# EAGLE schematic UHJ Ambisonic Decoder (EAGLE 9.0.1)

## Sheet 1 of 5: PSU (1 OF 1) psu, inpt bffrs
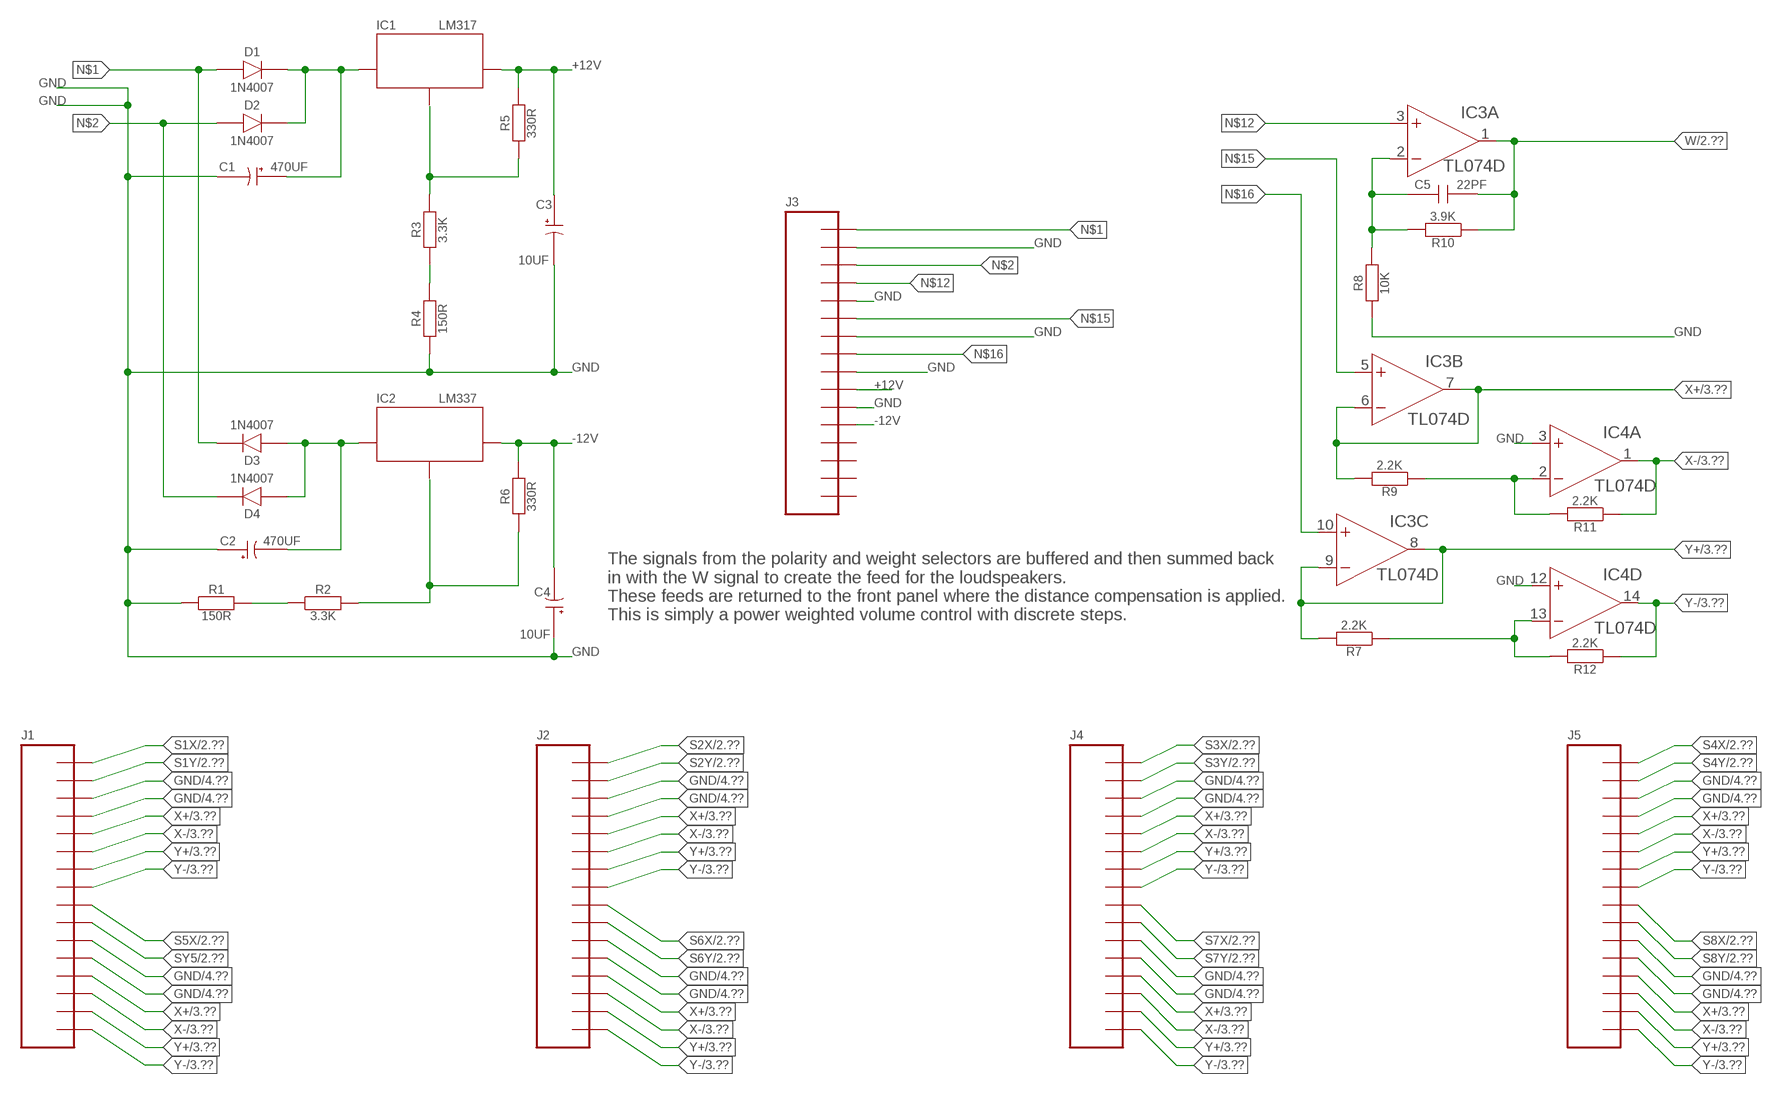
[diagram p0: schematic, sheet 1]

### Parts
C1  470UF  C+  [PANASONIC_E]
C2  470UF  C+  [PANASONIC_E]
C3  10UF  C+  [PANASONIC_E]
C4  10UF  C+  [PANASONIC_E]
C5  22PF  C  [CT6032]
D1  1N4007  D  [SOD123]
D2  1N4007  D  [SOD123]
D3  1N4007  D  [SOD123]
D4  1N4007  D  [SOD123]
IC1  LM317  VREG  [SO08]
IC2  LM337  VREG  [SO08]
IC3  TL074D  [SO14]
IC4  TL074D  [SO14]
J1  CON_16  [2X08SMT]
J2  CON_16  [2X08SMT]
J3  CON_16  [2X08SMT]
J4  CON_16  [2X08SMT]
J5  CON_16  [2X08SMT]
R1  150R  R  [R6332W]
R2  3.3K  R  [R6332W]
R3  3.3K  R  [R6332W]
R4  150R  R  [R6332W]
R5  330R  R  [R6332W]
R6  330R  R  [R6332W]
R7  2.2K  R  [R6332W]
R8  10K  R  [R6332W]
R9  2.2K  R  [R6332W]
R10  3.9K  R  [R6332W]
R11  2.2K  R  [R6332W]
R12  2.2K  R  [R6332W]

### Nets
+12V: C3.+ IC1.1(OUT) J3.10 R5.2 ; also sheet 4,5
-12V: C4.- IC2.1(OUT) J3.12 R6.2 ; also sheet 4,5
GND: C1.- C2.+ C3.- C4.+ IC4.3(A:+IN) IC4.12(D:+IN) J1.3 J1.4 J1.11 J1.12 J2.3 J2.4 J2.11 J2.12 J3.2 J3.5 J3.7 J3.9 J3.11 J4.3 J4.4 J4.11 J4.12 J5.3 J5.4 J5.11 J5.12 R1.1 R4.1 R8.1 ; also sheet 2,4,5
N$1: D1.A D3.C J3.1
N$2: D2.A D4.C J3.3
N$4: C1.+ D1.C D2.C IC1.8(IN)
N$5: C2.- D3.A D4.A IC2.8(IN)
N$7: IC1.2(GND) IC1.3(GND) IC1.6(GND) IC1.7(GND) R3.2 R5.1
N$8: R3.1 R4.2
N$10: IC2.2(GND) IC2.3(GND) IC2.6(GND) IC2.7(GND) R2.2 R6.1
N$12: IC3.3(A:+IN) J3.4
N$13: C5.- IC3.2(A:-IN) R8.2 R10.2
N$15: IC3.5(B:+IN) J3.6
N$16: IC3.10(C:+IN) J3.8
N$18: IC4.2(A:-IN) R9.1 R11.2
N$20: IC4.13(D:-IN) R7.1 R12.2
N$21: R1.2 R2.1
S1X: J1.1 ; also sheet 2
S1Y: J1.2 ; also sheet 2
S2X: J2.1 ; also sheet 2
S2Y: J2.2 ; also sheet 2
S3X: J4.1 ; also sheet 2
S3Y: J4.2 ; also sheet 2
S4X: J5.1 ; also sheet 2
S4Y: J5.2 ; also sheet 2
S5X: J1.9 ; also sheet 2
S6X: J2.9 ; also sheet 2
S6Y: J2.10 ; also sheet 2
S7X: J4.9 ; also sheet 2
S7Y: J4.10 ; also sheet 2
S8X: J5.9 ; also sheet 2
S8Y: J5.10 ; also sheet 2
SY5: J1.10 ; also sheet 2
W: C5.+ IC3.1(A:OUT) R10.1 ; also sheet 2,5
X+: IC3.6(B:-IN) IC3.7(B:OUT) J1.5 J1.13 J2.5 J2.13 J4.5 J4.13 J5.5 J5.13 R9.2 ; also sheet 3
X-: IC4.1(A:OUT) J1.6 J1.14 J2.6 J2.14 J4.6 J4.14 J5.6 J5.14 R11.1 ; also sheet 3,4
Y+: IC3.8(C:OUT) IC3.9(C:-IN) J1.7 J1.15 J2.7 J2.15 J4.7 J4.15 J5.7 J5.15 R7.2 ; also sheet 3
Y-: IC4.14(D:OUT) J1.8 J1.16 J2.8 J2.16 J4.8 J4.16 J5.8 J5.16 R12.1 ; also sheet 3,4
Unconnected: IC3.12(D:+IN) IC3.13(D:-IN) IC3.14(D:OUT) IC4.5(B:+IN) IC4.6(B:-IN) IC4.7(B:OUT) IC4.8(C:OUT) IC4.9(C:-IN) IC4.10(C:+IN) J3.13 J3.14 J3.15 J3.16

### Notes on the sheet
- The signals from the polarity and weight selectors are buffered and then summed back
  in with the W signal to create the feed for the loudspeakers. 
  These feeds are returned to the front panel where the distance compensation is applied.
  This is simply a power weighted volume control with discrete steps.

## Sheet 2 of 5: DECODER (1 OF 4) sin-cos pots, angl sel, dstnc cmp
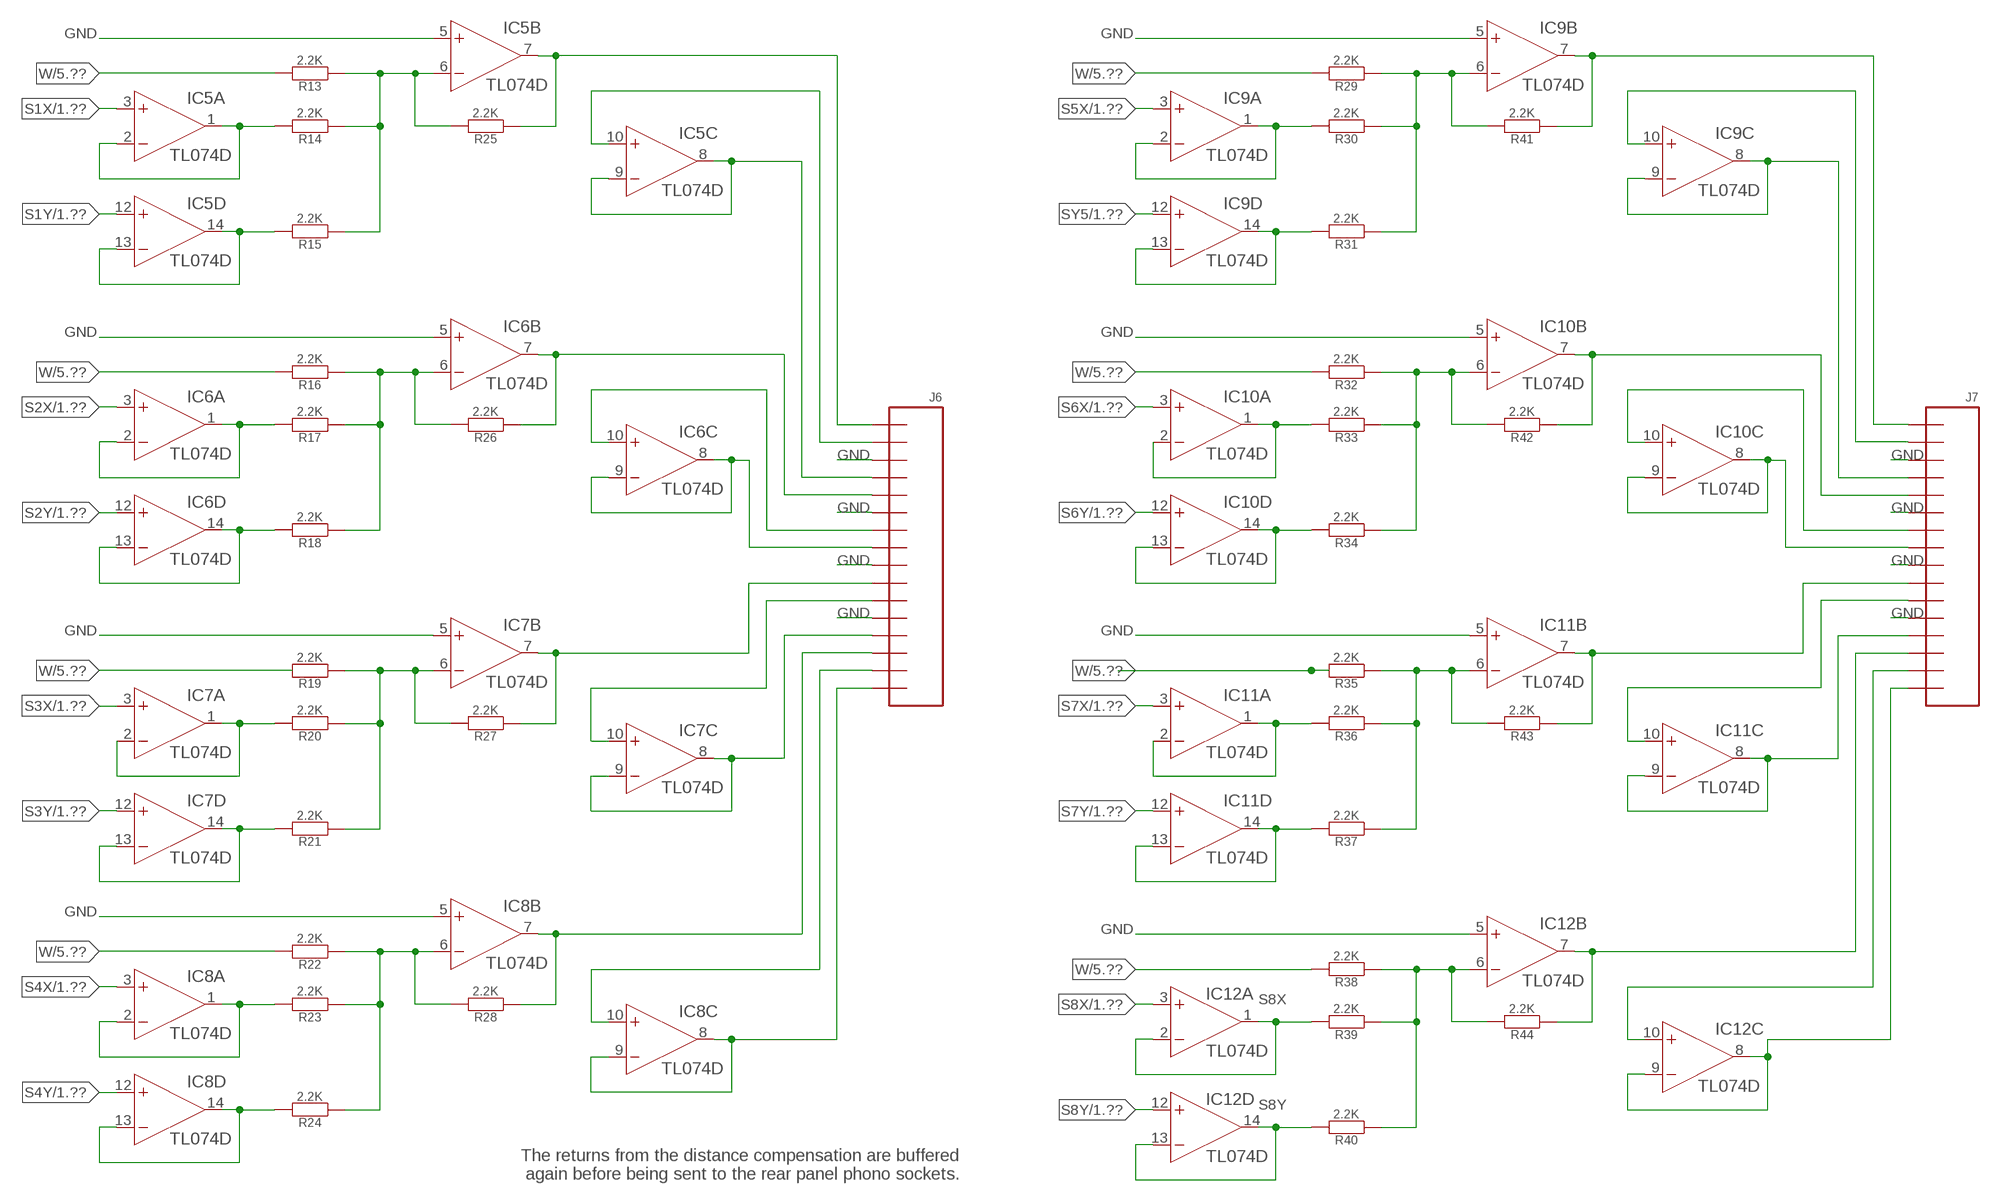
[diagram p1: schematic, sheet 2]

### Parts
IC5  TL074D  [SO14]
IC6  TL074D  [SO14]
IC7  TL074D  [SO14]
IC8  TL074D  [SO14]
IC9  TL074D  [SO14]
IC10  TL074D  [SO14]
IC11  TL074D  [SO14]
IC12  TL074D  [SO14]
J6  CON_16  [2X08SMT]
J7  CON_16  [2X08SMT]
R13  2.2K  R  [R6332W]
R14  2.2K  R  [R6332W]
R15  2.2K  R  [R6332W]
R16  2.2K  R  [R6332W]
R17  2.2K  R  [R6332W]
R18  2.2K  R  [R6332W]
R19  2.2K  R  [R6332W]
R20  2.2K  R  [R6332W]
R21  2.2K  R  [R6332W]
R22  2.2K  R  [R6332W]
R23  2.2K  R  [R6332W]
R24  2.2K  R  [R6332W]
R25  2.2K  R  [R6332W]
R26  2.2K  R  [R6332W]
R27  2.2K  R  [R6332W]
R28  2.2K  R  [R6332W]
R29  2.2K  R  [R6332W]
R30  2.2K  R  [R6332W]
R31  2.2K  R  [R6332W]
R32  2.2K  R  [R6332W]
R33  2.2K  R  [R6332W]
R34  2.2K  R  [R6332W]
R35  2.2K  R  [R6332W]
R36  2.2K  R  [R6332W]
R37  2.2K  R  [R6332W]
R38  2.2K  R  [R6332W]
R39  2.2K  R  [R6332W]
R40  2.2K  R  [R6332W]
R41  2.2K  R  [R6332W]
R42  2.2K  R  [R6332W]
R43  2.2K  R  [R6332W]
R44  2.2K  R  [R6332W]

### Nets
GND: IC5.5(B:+IN) IC6.5(B:+IN) IC7.5(B:+IN) IC8.5(B:+IN) IC9.5(B:+IN) IC10.5(B:+IN) IC11.5(B:+IN) IC12.5(B:+IN) J6.3 J6.6 J6.9 J6.12 J7.3 J7.6 J7.9 J7.12 ; also sheet 1,4,5
N$3: IC5.8(C:OUT) IC5.9(C:-IN) J6.4
N$6: IC7.8(C:OUT) IC7.9(C:-IN) J6.13
N$17: IC6.8(C:OUT) IC6.9(C:-IN) J6.8
N$30: IC9.1(A:OUT) IC9.2(A:-IN) R30.2
N$41: IC6.1(A:OUT) IC6.2(A:-IN) R17.2
N$82: IC6.13(D:-IN) IC6.14(D:OUT) R18.2
N$96: IC5.10(C:+IN) J6.2
N$101: IC6.10(C:+IN) J6.7
N$102: IC9.7(B:OUT) J7.1 R41.1
N$103: IC6.6(B:-IN) R16.1 R17.1 R18.1 R26.2
N$104: IC9.13(D:-IN) IC9.14(D:OUT) R31.2
N$105: IC5.13(D:-IN) IC5.14(D:OUT) R15.2
N$106: IC5.6(B:-IN) R13.1 R14.1 R15.1 R25.2
N$107: IC5.7(B:OUT) J6.1 R25.1
N$109: IC5.1(A:OUT) IC5.2(A:-IN) R14.2
N$110: IC6.7(B:OUT) J6.5 R26.1
N$111: IC8.1(A:OUT) IC8.2(A:-IN) R23.2
N$112: IC8.13(D:-IN) IC8.14(D:OUT) R24.2
N$113: IC8.6(B:-IN) R22.1 R23.1 R24.1 R28.2
N$114: IC8.10(C:+IN) J6.15
N$115: IC7.13(D:-IN) IC7.14(D:OUT) R21.2
N$116: IC7.6(B:-IN) R19.1 R20.1 R21.1 R27.2
N$117: IC7.7(B:OUT) J6.10 R27.1
N$119: IC7.1(A:OUT) IC7.2(A:-IN) R20.2
N$120: IC8.7(B:OUT) J6.14 R28.1
N$124: IC10.10(C:+IN) J7.7
N$125: IC9.6(B:-IN) R29.1 R30.1 R31.1 R41.2
N$127: IC10.13(D:-IN) IC10.14(D:OUT) R34.2
N$129: IC12.10(C:+IN) J7.15
N$131: IC10.6(B:-IN) R32.1 R33.1 R34.1 R42.2
N$133: IC12.8(C:OUT) IC12.9(C:-IN) J7.16
N$134: IC10.7(B:OUT) J7.5 R42.1
N$135: IC10.1(A:OUT) IC10.2(A:-IN) R33.2
N$137: IC12.1(A:OUT) IC12.2(A:-IN) R39.2
N$138: IC12.13(D:-IN) IC12.14(D:OUT) R40.2
N$139: IC12.6(B:-IN) R38.1 R39.1 R40.1 R44.2
N$140: IC11.8(C:OUT) IC11.9(C:-IN) J7.13
N$141: IC11.13(D:-IN) IC11.14(D:OUT) R37.2
N$142: IC11.6(B:-IN) R35.1 R36.1 R37.1 R43.2
N$143: IC11.7(B:OUT) J7.10 R43.1
N$144: IC11.1(A:OUT) IC11.2(A:-IN) R36.2
N$150: IC8.8(C:OUT) IC8.9(C:-IN) J6.16
N$154: IC9.8(C:OUT) IC9.9(C:-IN) J7.4
N$826: IC7.10(C:+IN) J6.11
N$830: IC12.7(B:OUT) J7.14 R44.1
N$833: IC10.8(C:OUT) IC10.9(C:-IN) J7.8
N$834: IC9.10(C:+IN) J7.2
N$838: IC11.10(C:+IN) J7.11
S1X: IC5.3(A:+IN) ; also sheet 1
S1Y: IC5.12(D:+IN) ; also sheet 1
S2X: IC6.3(A:+IN) ; also sheet 1
S2Y: IC6.12(D:+IN) ; also sheet 1
S3X: IC7.3(A:+IN) ; also sheet 1
S3Y: IC7.12(D:+IN) ; also sheet 1
S4X: IC8.3(A:+IN) ; also sheet 1
S4Y: IC8.12(D:+IN) ; also sheet 1
S5X: IC9.3(A:+IN) ; also sheet 1
S6X: IC10.3(A:+IN) ; also sheet 1
S6Y: IC10.12(D:+IN) ; also sheet 1
S7X: IC11.3(A:+IN) ; also sheet 1
S7Y: IC11.12(D:+IN) ; also sheet 1
S8X: IC12.3(A:+IN) ; also sheet 1
S8Y: IC12.12(D:+IN) ; also sheet 1
SY5: IC9.12(D:+IN) ; also sheet 1
W: R13.2 R16.2 R19.2 R22.2 R29.2 R32.2 R35.2 R38.2 ; also sheet 1,5

### Notes on the sheet
- The returns from the distance compensation are buffered
   again before being sent to the rear panel phono sockets.

## Sheet 3 of 5: DECODER (2 OF 4) sector sel wfr swtchs
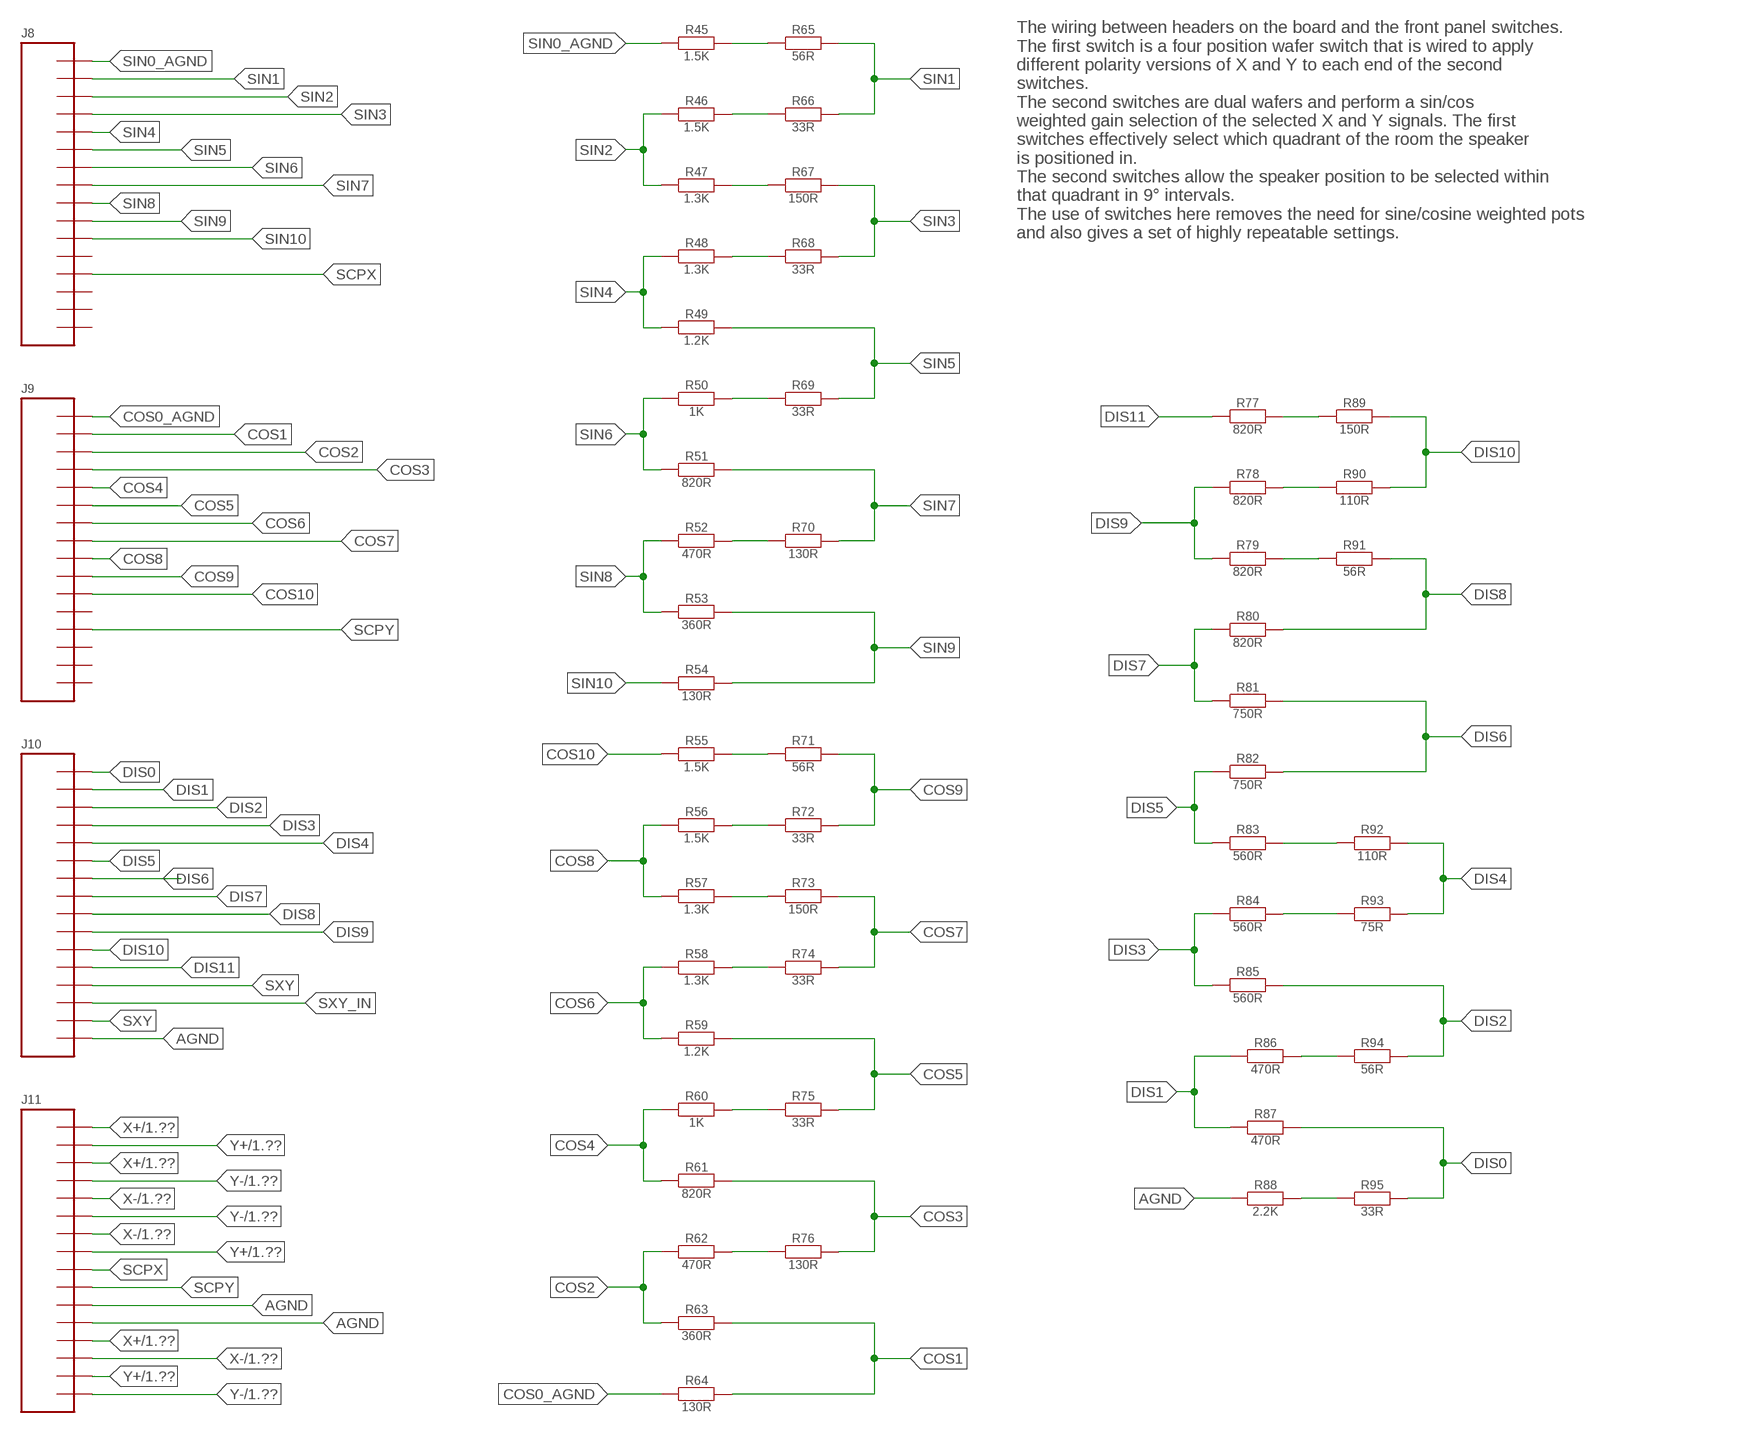
[diagram p2: schematic, sheet 3]

### Parts
J8  CON_16  [2X08SMT]
J9  CON_16  [2X08SMT]
J10  CON_16  [2X08SMT]
J11  CON_16  [2X08SMT]
R45  1.5K  R  [R6332W]
R46  1.5K  R  [R6332W]
R47  1.3K  R  [R6332W]
R48  1.3K  R  [R6332W]
R49  1.2K  R  [R6332W]
R50  1K  R  [R6332W]
R51  820R  R  [R6332W]
R52  470R  R  [R6332W]
R53  360R  R  [R6332W]
R54  130R  R  [R6332W]
R55  1.5K  R  [R6332W]
R56  1.5K  R  [R6332W]
R57  1.3K  R  [R6332W]
R58  1.3K  R  [R6332W]
R59  1.2K  R  [R6332W]
R60  1K  R  [R6332W]
R61  820R  R  [R6332W]
R62  470R  R  [R6332W]
R63  360R  R  [R6332W]
R64  130R  R  [R6332W]
R65  56R  R  [R6332W]
R66  33R  R  [R6332W]
R67  150R  R  [R6332W]
R68  33R  R  [R6332W]
R69  33R  R  [R6332W]
R70  130R  R  [R6332W]
R71  56R  R  [R6332W]
R72  33R  R  [R6332W]
R73  150R  R  [R6332W]
R74  33R  R  [R6332W]
R75  33R  R  [R6332W]
R76  130R  R  [R6332W]
R77  820R  R  [R6332W]
R78  820R  R  [R6332W]
R79  820R  R  [R6332W]
R80  820R  R  [R6332W]
R81  750R  R  [R6332W]
R82  750R  R  [R6332W]
R83  560R  R  [R6332W]
R84  560R  R  [R6332W]
R85  560R  R  [R6332W]
R86  470R  R  [R6332W]
R87  470R  R  [R6332W]
R88  2.2K  R  [R6332W]
R89  150R  R  [R6332W]
R90  110R  R  [R6332W]
R91  56R  R  [R6332W]
R92  110R  R  [R6332W]
R93  75R  R  [R6332W]
R94  56R  R  [R6332W]
R95  33R  R  [R6332W]

### Nets
AGND: J10.16 J11.11 J11.12 R88.1
COS0_AGND: J9.1 R64.1
COS1: J9.2 R63.2 R64.2
COS2: J9.3 R62.1 R63.1
COS3: J9.4 R61.2 R76.2
COS4: J9.5 R60.1 R61.1
COS5: J9.6 R59.2 R75.2
COS6: J9.7 R58.1 R59.1
COS7: J9.8 R73.2 R74.2
COS8: J9.9 R56.1 R57.1
COS9: J9.10 R71.2 R72.2
COS10: J9.11 R55.1
DIS0: J10.1 R87.2 R95.2
DIS1: J10.2 R86.1 R87.1
DIS2: J10.3 R85.2 R94.2
DIS3: J10.4 R84.1 R85.1
DIS4: J10.5 R92.2 R93.2
DIS5: J10.6 R82.1 R83.1
DIS6: J10.7 R81.2 R82.2
DIS7: J10.8 R80.1 R81.1
DIS8: J10.9 R80.2 R91.2
DIS9: J10.10 R78.1 R79.1
DIS10: J10.11 R89.2 R90.2
DIS11: J10.12 R77.1
N$128: R45.2 R65.1
N$147: R46.2 R66.1
N$828: R47.2 R67.1
N$831: R48.2 R68.1
N$836: R50.2 R69.1
N$840: R52.2 R70.1
N$845: R55.2 R71.1
N$847: R56.2 R72.1
N$849: R57.2 R73.1
N$851: R58.2 R74.1
N$854: R60.2 R75.1
N$857: R62.2 R76.1
N$862: R77.2 R89.1
N$864: R78.2 R90.1
N$866: R79.2 R91.1
N$871: R83.2 R92.1
N$873: R84.2 R93.1
N$876: R86.2 R94.1
N$879: R88.2 R95.1
SCPX: J8.13 J11.9
SCPY: J9.13 J11.10
SIN0_AGND: J8.1 R45.1
SIN1: J8.2 R65.2 R66.2
SIN2: J8.3 R46.1 R47.1
SIN3: J8.4 R67.2 R68.2
SIN4: J8.5 R48.1 R49.1
SIN5: J8.6 R49.2 R69.2
SIN6: J8.7 R50.1 R51.1
SIN7: J8.8 R51.2 R70.2
SIN8: J8.9 R52.1 R53.1
SIN9: J8.10 R53.2 R54.2
SIN10: J8.11 R54.1
SXY: J10.13 J10.15
SXY_IN: J10.14
X+: J11.1 J11.3 J11.13 ; also sheet 1
X-: J11.5 J11.7 J11.14 ; also sheet 1,4
Y+: J11.2 J11.8 J11.15 ; also sheet 1
Y-: J11.4 J11.6 J11.16 ; also sheet 1,4
Unconnected: J8.12 J8.14 J8.15 J8.16 J9.12 J9.14 J9.15 J9.16

### Notes on the sheet
- The wiring between headers on the board and the front panel switches. 
  The first switch is a four position wafer switch that is wired to apply 
  different polarity versions of X and Y to each end of the second 
  switches. 
  The second switches are dual wafers and perform a sin/cos
  weighted gain selection of the selected X and Y signals. The first 
  switches effectively select which quadrant of the room the speaker 
  is positioned in. 
  The second switches allow the speaker position to be selected within 
  that quadrant in 9° intervals. 
  The use of switches here removes the need for sine/cosine weighted pots 
  and also gives a set of highly repeatable settings.

## Sheet 4 of 5: DECODER (3 OF 4) uhj mtrx, phase seq array
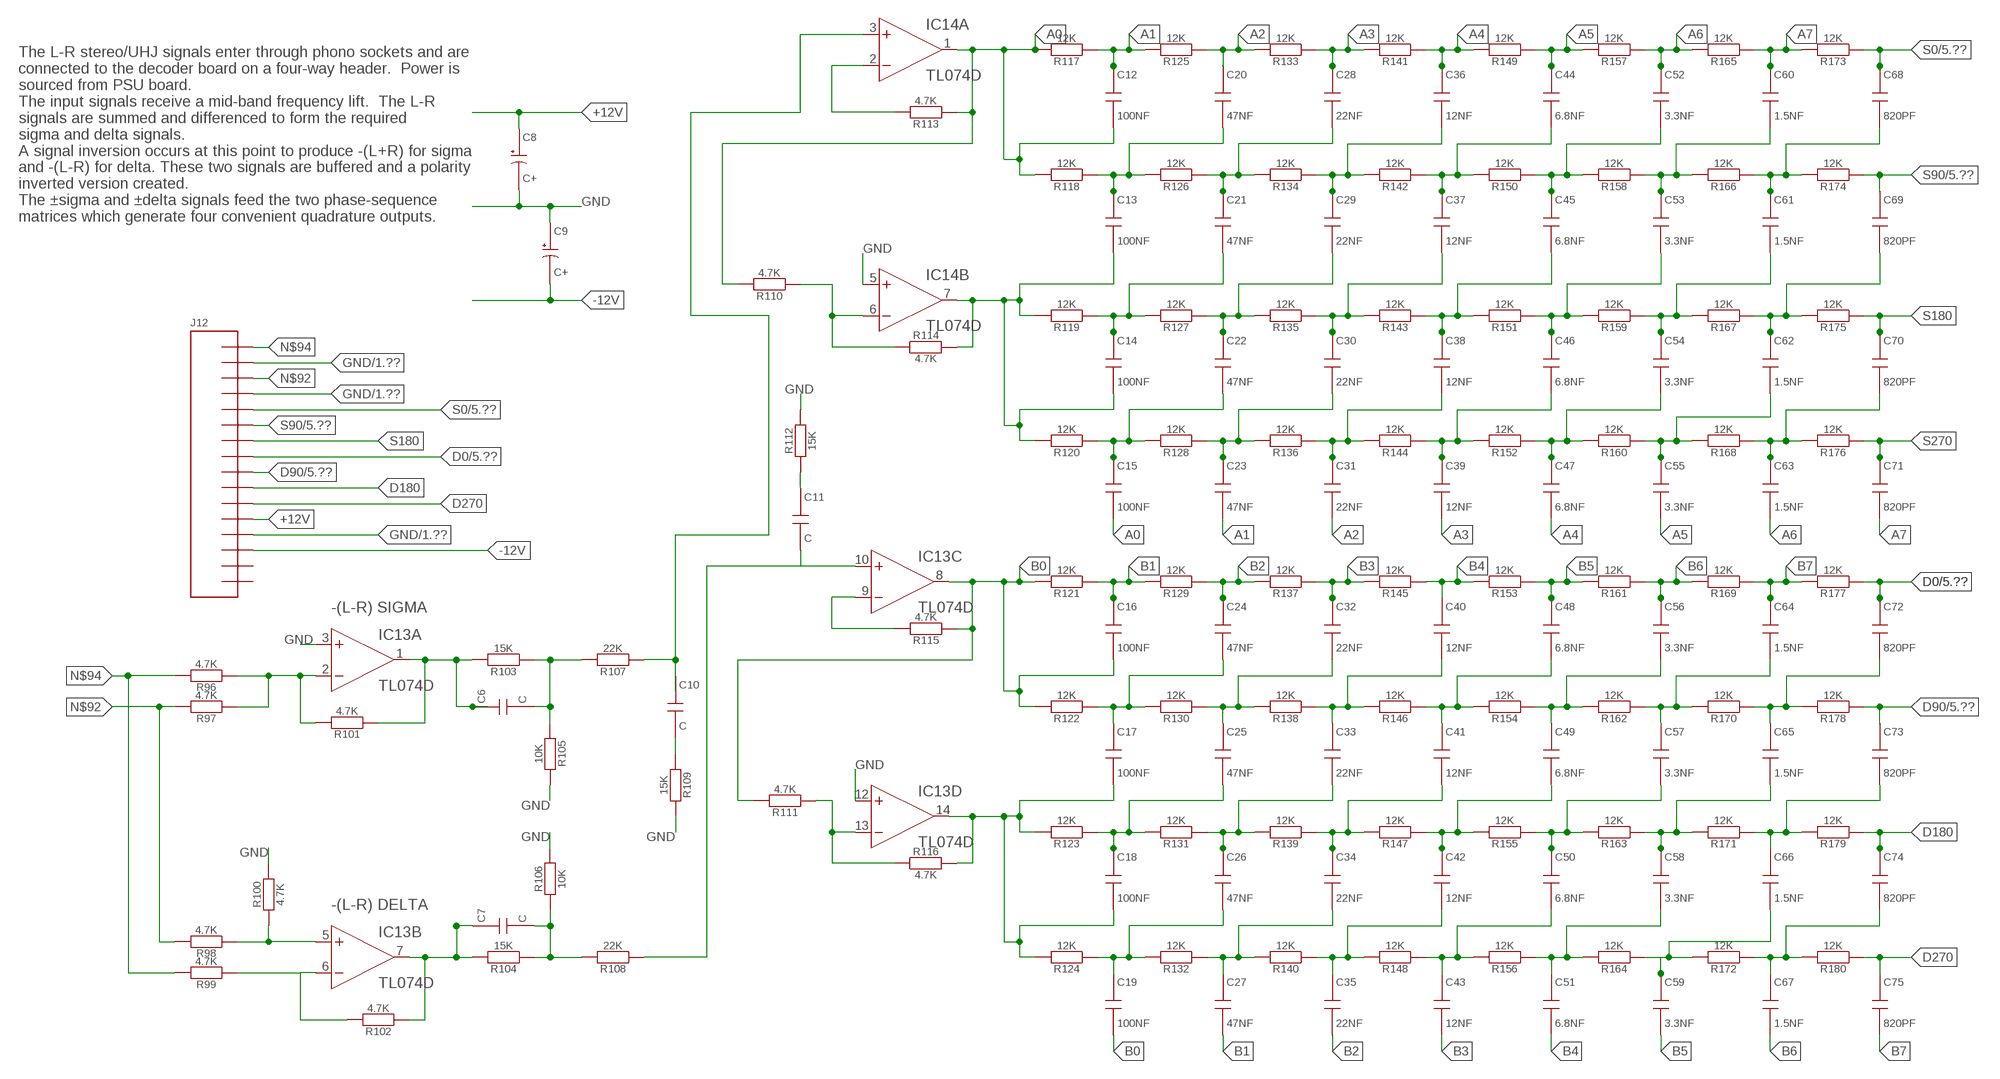
[diagram p3: schematic, sheet 4]

### Parts
C6  C  [CT6032]
C7  C  [CT6032]
C8  C+  [PANASONIC_E]
C9  C+  [PANASONIC_E]
C10  C  [CT6032]
C11  C  [CT6032]
C12  100NF  C  [CT6032]
C13  100NF  C  [CT6032]
C14  100NF  C  [CT6032]
C15  100NF  C  [CT6032]
C16  100NF  C  [CT6032]
C17  100NF  C  [CT6032]
C18  100NF  C  [CT6032]
C19  100NF  C  [CT6032]
C20  47NF  C  [CT6032]
C21  47NF  C  [CT6032]
C22  47NF  C  [CT6032]
C23  47NF  C  [CT6032]
C24  47NF  C  [CT6032]
C25  47NF  C  [CT6032]
C26  47NF  C  [CT6032]
C27  47NF  C  [CT6032]
C28  22NF  C  [CT6032]
C29  22NF  C  [CT6032]
C30  22NF  C  [CT6032]
C31  22NF  C  [CT6032]
C32  22NF  C  [CT6032]
C33  22NF  C  [CT6032]
C34  22NF  C  [CT6032]
C35  22NF  C  [CT6032]
C36  12NF  C  [CT6032]
C37  12NF  C  [CT6032]
C38  12NF  C  [CT6032]
C39  12NF  C  [CT6032]
C40  12NF  C  [CT6032]
C41  12NF  C  [CT6032]
C42  12NF  C  [CT6032]
C43  12NF  C  [CT6032]
C44  6.8NF  C  [CT6032]
C45  6.8NF  C  [CT6032]
C46  6.8NF  C  [CT6032]
C47  6.8NF  C  [CT6032]
C48  6.8NF  C  [CT6032]
C49  6.8NF  C  [CT6032]
C50  6.8NF  C  [CT6032]
C51  6.8NF  C  [CT6032]
C52  3.3NF  C  [CT6032]
C53  3.3NF  C  [CT6032]
C54  3.3NF  C  [CT6032]
C55  3.3NF  C  [CT6032]
C56  3.3NF  C  [CT6032]
C57  3.3NF  C  [CT6032]
C58  3.3NF  C  [CT6032]
C59  3.3NF  C  [CT6032]
C60  1.5NF  C  [CT6032]
C61  1.5NF  C  [CT6032]
C62  1.5NF  C  [CT6032]
C63  1.5NF  C  [CT6032]
C64  1.5NF  C  [CT6032]
C65  1.5NF  C  [CT6032]
C66  1.5NF  C  [CT6032]
C67  1.5NF  C  [CT6032]
C68  820PF  C  [CT6032]
C69  820PF  C  [CT6032]
C70  820PF  C  [CT6032]
C71  820PF  C  [CT6032]
C72  820PF  C  [CT6032]
C73  820PF  C  [CT6032]
C74  820PF  C  [CT6032]
C75  820PF  C  [CT6032]
IC13  TL074D  [SO14]
IC14  TL074D  [SO14]
J12  CON_16  [2X08SMT]
R96  4.7K  R  [R6332W]
R97  4.7K  R  [R6332W]
R98  4.7K  R  [R6332W]
R99  4.7K  R  [R6332W]
R100  4.7K  R  [R6332W]
R101  4.7K  R  [R6332W]
R102  4.7K  R  [R6332W]
R103  15K  R  [R6332W]
R104  15K  R  [R6332W]
R105  10K  R  [R6332W]
R106  10K  R  [R6332W]
R107  22K  R  [R6332W]
R108  22K  R  [R6332W]
R109  15K  R  [R6332W]
R110  4.7K  R  [R6332W]
R111  4.7K  R  [R6332W]
R112  15K  R  [R6332W]
R113  4.7K  R  [R6332W]
R114  4.7K  R  [R6332W]
R115  4.7K  R  [R6332W]
R116  4.7K  R  [R6332W]
R117  12K  R  [R6332W]
R118  12K  R  [R6332W]
R119  12K  R  [R6332W]
R120  12K  R  [R6332W]
R121  12K  R  [R6332W]
R122  12K  R  [R6332W]
R123  12K  R  [R6332W]
R124  12K  R  [R6332W]
R125  12K  R  [R6332W]
R126  12K  R  [R6332W]
R127  12K  R  [R6332W]
R128  12K  R  [R6332W]
R129  12K  R  [R6332W]
R130  12K  R  [R6332W]
R131  12K  R  [R6332W]
R132  12K  R  [R6332W]
R133  12K  R  [R6332W]
R134  12K  R  [R6332W]
R135  12K  R  [R6332W]
R136  12K  R  [R6332W]
R137  12K  R  [R6332W]
R138  12K  R  [R6332W]
R139  12K  R  [R6332W]
R140  12K  R  [R6332W]
R141  12K  R  [R6332W]
R142  12K  R  [R6332W]
R143  12K  R  [R6332W]
R144  12K  R  [R6332W]
R145  12K  R  [R6332W]
R146  12K  R  [R6332W]
R147  12K  R  [R6332W]
R148  12K  R  [R6332W]
R149  12K  R  [R6332W]
R150  12K  R  [R6332W]
R151  12K  R  [R6332W]
R152  12K  R  [R6332W]
R153  12K  R  [R6332W]
R154  12K  R  [R6332W]
R155  12K  R  [R6332W]
R156  12K  R  [R6332W]
R157  12K  R  [R6332W]
R158  12K  R  [R6332W]
R159  12K  R  [R6332W]
R160  12K  R  [R6332W]
R161  12K  R  [R6332W]
R162  12K  R  [R6332W]
R163  12K  R  [R6332W]
R164  12K  R  [R6332W]
R165  12K  R  [R6332W]
R166  12K  R  [R6332W]
R167  12K  R  [R6332W]
R168  12K  R  [R6332W]
R169  12K  R  [R6332W]
R170  12K  R  [R6332W]
R171  12K  R  [R6332W]
R172  12K  R  [R6332W]
R173  12K  R  [R6332W]
R174  12K  R  [R6332W]
R175  12K  R  [R6332W]
R176  12K  R  [R6332W]
R177  12K  R  [R6332W]
R178  12K  R  [R6332W]
R179  12K  R  [R6332W]
R180  12K  R  [R6332W]

### Nets
+12V: C8.+ J12.12 ; also sheet 1,5
-12V: C9.- J12.14 ; also sheet 1,5
A0: C12.- C15.- IC14.1(A:OUT) R110.2 R113.1 R117.2 R118.2
A1: C12.+ C23.- R117.1 R125.2
A2: C20.+ C31.- R125.1 R133.2
A3: C28.+ C39.- R133.1 R141.2
A4: C36.+ C47.- R141.1 R149.2
A5: C44.+ C55.- R149.1 R157.2
A6: C52.+ C63.- R157.1 R165.2
A7: C60.+ C71.- R165.1 R173.2
B0: C16.- C19.- IC13.8(C:OUT) R111.2 R115.1 R121.2 R122.2
B1: C16.+ C27.- R121.1 R129.2
B2: C24.+ C35.- R129.1 R137.2
B3: C32.+ C43.- R137.1 R145.2
B4: C40.+ C51.- R145.1 R153.2
B5: C48.+ C59.- R153.1 R161.2
B6: C56.+ C67.- R161.1 R169.2
B7: C64.+ C75.- R169.1 R177.2
D0: C72.+ J12.8 R177.1 ; also sheet 5
D90: C73.+ J12.9 R178.1 ; also sheet 5
D180: C74.+ J12.10 R179.1
D270: C75.+ J12.11 R180.1
GND: C8.- C9.+ IC13.3(A:+IN) IC14.5(B:+IN) J12.2 J12.4 J12.13 R100.2 R105.2 R106.2 R109.2 R112.2 ; also sheet 1,2,5
N$9: C59.+ C66.- R164.1 R172.2
N$14: C65.+ C72.- R170.1 R178.2
N$25: C55.+ C62.- R160.1 R168.2
N$33: C13.+ C20.- R118.1 R126.2
N$34: C21.+ C28.- R126.1 R134.2
N$35: C29.+ C36.- R134.1 R142.2
N$36: C37.+ C44.- R142.1 R150.2
N$37: C45.+ C52.- R150.1 R158.2
N$38: C53.+ C60.- R158.1 R166.2
N$39: C61.+ C68.- R166.1 R174.2
N$44: C14.+ C21.- R119.1 R127.2
N$45: C22.+ C29.- R127.1 R135.2
N$46: C30.+ C37.- R135.1 R143.2
N$47: C38.+ C45.- R143.1 R151.2
N$48: C46.+ C53.- R151.1 R159.2
N$49: C54.+ C61.- R159.1 R167.2
N$50: C62.+ C69.- R167.1 R175.2
N$52: C15.+ C22.- R120.1 R128.2
N$53: C23.+ C30.- R128.1 R136.2
N$54: C31.+ C38.- R136.1 R144.2
N$55: C39.+ C46.- R144.1 R152.2
N$56: C47.+ C54.- R152.1 R160.2
N$58: C63.+ C70.- R168.1 R176.2
N$63: C17.+ C24.- R122.1 R130.2
N$64: C25.+ C32.- R130.1 R138.2
N$66: C33.+ C40.- R138.1 R146.2
N$69: C41.+ C48.- R146.1 R154.2
N$70: C49.+ C56.- R154.1 R162.2
N$71: C57.+ C64.- R162.1 R170.2
N$73: C18.+ C25.- R123.1 R131.2
N$74: C26.+ C33.- R131.1 R139.2
N$75: C34.+ C41.- R139.1 R147.2
N$76: C42.+ C49.- R147.1 R155.2
N$77: C50.+ C57.- R155.1 R163.2
N$78: C58.+ C65.- R163.1 R171.2
N$79: C66.+ C73.- R171.1 R179.2
N$81: C19.+ C26.- R124.1 R132.2
N$83: C27.+ C34.- R132.1 R140.2
N$84: C35.+ C42.- R140.1 R148.2
N$85: C43.+ C50.- R148.1 R156.2
N$86: C51.+ C58.- R156.1 R164.2
N$90: IC13.2(A:-IN) R96.1 R97.1 R101.2
N$91: IC13.6(B:-IN) R99.1 R102.2
N$92: J12.3 R97.2 R98.2
N$93: IC13.5(B:+IN) R98.1 R100.1
N$94: J12.1 R96.2 R99.2
N$97: C67.+ C74.- R172.1 R180.2
N$118: IC13.9(C:-IN) R115.2
N$122: C17.- C18.- IC13.14(D:OUT) R116.2 R123.2 R124.2
N$132: IC13.13(D:-IN) R111.1 R116.1
N$151: C6.- R103.1 R105.1 R107.2
N$152: C10.+ IC14.3(A:+IN) R107.1
N$155: C10.- R109.1
N$156: C7.- R104.1 R106.1 R108.2
N$158: C11.- IC13.10(C:+IN) R108.1
N$159: C11.+ R112.1
N$164: IC14.2(A:-IN) R113.2
N$166: C13.- C14.- IC14.7(B:OUT) R114.2 R119.2 R120.2
N$167: IC14.6(B:-IN) R110.1 R114.1
S0: C68.+ J12.5 R173.1 ; also sheet 5
S90: C69.+ J12.6 R174.1 ; also sheet 5
S180: C70.+ J12.7 R175.1
S270: C71.+ R176.1
X-: C6.+ IC13.1(A:OUT) R101.1 R103.2 ; also sheet 1,3
Y-: C7.+ IC13.7(B:OUT) R102.1 R104.2 ; also sheet 1,3
Unconnected: IC13.12(D:+IN) J12.15 J12.16

### Notes on the sheet
- The L-R stereo/UHJ signals enter through phono sockets and are 
  connected to the decoder board on a four-way header.  Power is 
  sourced from PSU board. 
  The input signals receive a mid-band frequency lift.  The L-R 
  signals are summed and differenced to form the required 
  sigma and delta signals. 
  A signal inversion occurs at this point to produce -(L+R) for sigma 
  and -(L-R) for delta. These two signals are buffered and a polarity 
  inverted version created. 
  The ±sigma and ±delta signals feed the two phase-sequence 
  matrices which generate four convenient quadrature outputs.
- -(L-R) SIGMA
- -(L-R) DELTA

## Sheet 5 of 5: DECODER (4 OF 4) w sub drv, mtrx sum, outs
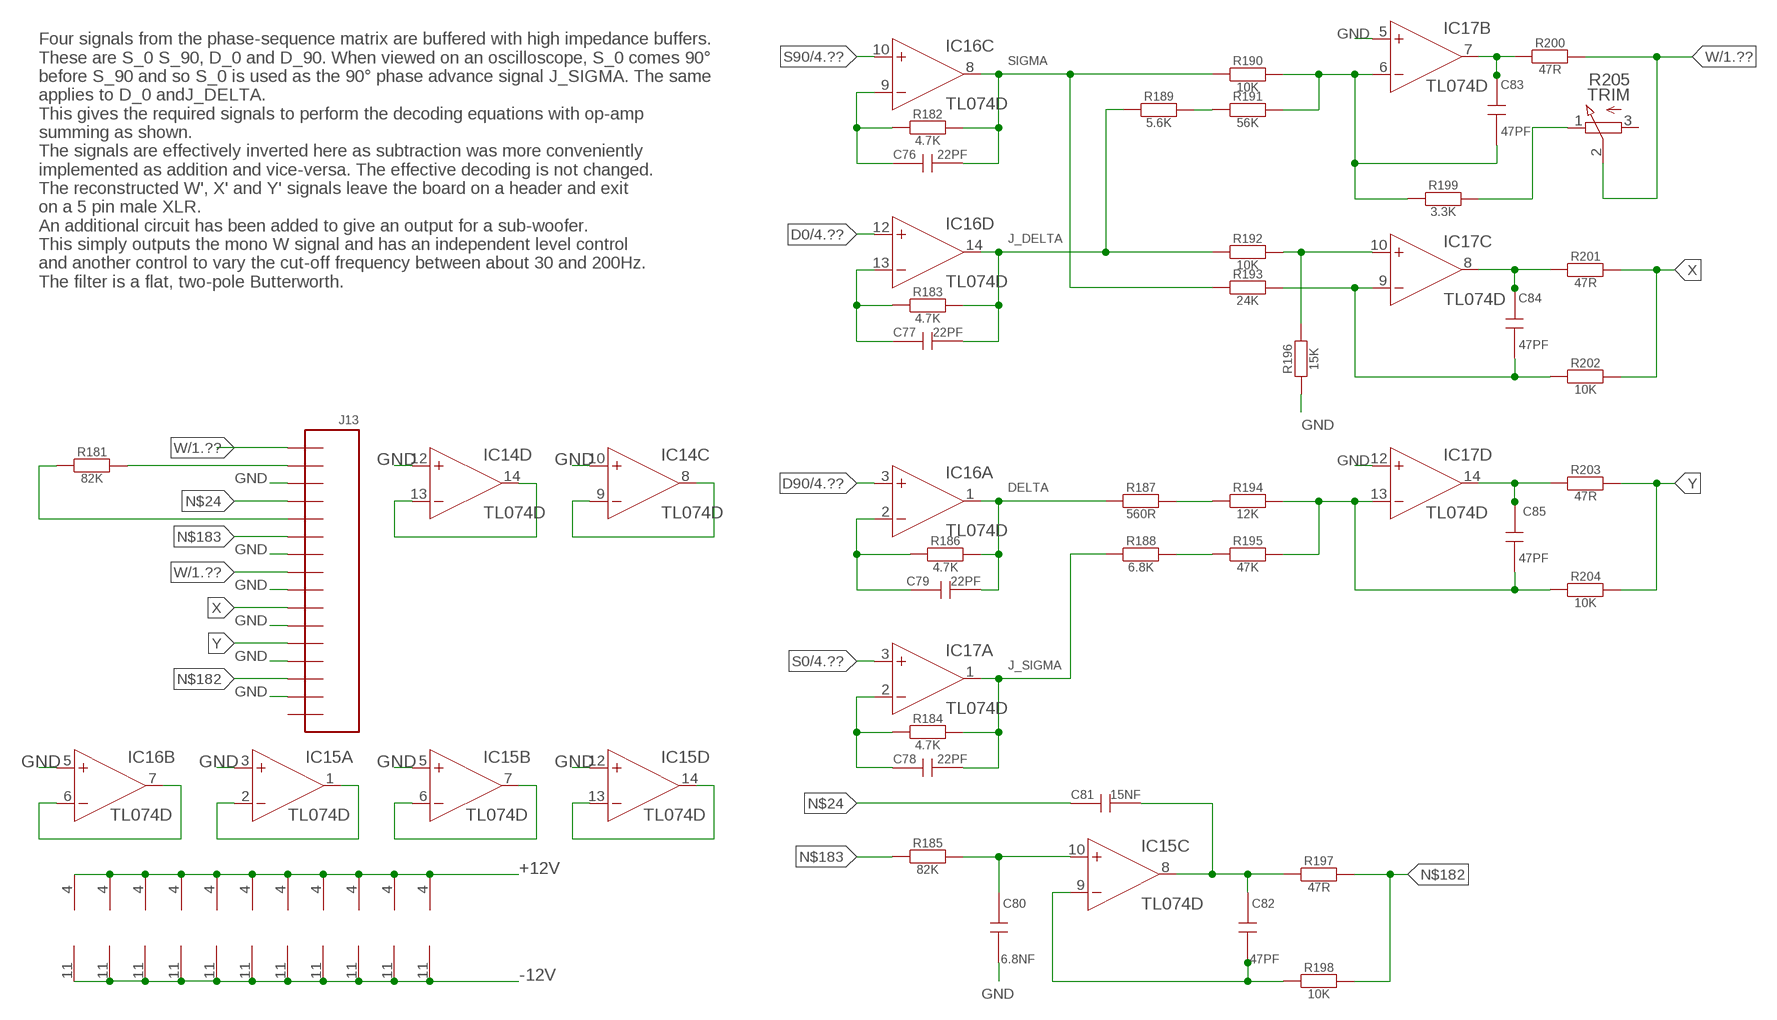
[diagram p4: schematic, sheet 5]

### Parts
C76  22PF  C  [CT6032]
C77  22PF  C  [CT6032]
C78  22PF  C  [CT6032]
C79  22PF  C  [CT6032]
C80  6.8NF  C  [CT6032]
C81  15NF  C  [CT6032]
C82  47PF  C  [CT6032]
C83  47PF  C  [CT6032]
C84  47PF  C  [CT6032]
C85  47PF  C  [CT6032]
IC15  TL074D  [SO14]
IC16  TL074D  [SO14]
IC17  TL074D  [SO14]
J13  CON_16  [2X08SMT]
R181  82K  R  [R6332W]
R182  4.7K  R  [R6332W]
R183  4.7K  R  [R6332W]
R184  4.7K  R  [R6332W]
R185  82K  R  [R6332W]
R186  4.7K  R  [R6332W]
R187  560R  R  [R6332W]
R188  6.8K  R  [R6332W]
R189  5.6K  R  [R6332W]
R190  10K  R  [R6332W]
R191  56K  R  [R6332W]
R192  10K  R  [R6332W]
R193  24K  R  [R6332W]
R194  12K  R  [R6332W]
R195  47K  R  [R6332W]
R196  15K  R  [R6332W]
R197  47R  R  [R6332W]
R198  10K  R  [R6332W]
R199  3.3K  R  [R6332W]
R200  47R  R  [R6332W]
R201  47R  R  [R6332W]
R202  10K  R  [R6332W]
R203  47R  R  [R6332W]
R204  10K  R  [R6332W]
R205  TRIM  [TRIM]

### Nets
+12V: IC5.4(P:V+) IC6.4(P:V+) IC7.4(P:V+) IC8.4(P:V+) IC9.4(P:V+) IC10.4(P:V+) IC11.4(P:V+) IC12.4(P:V+) IC15.4(P:V+) IC16.4(P:V+) IC17.4(P:V+) ; also sheet 1,4
-12V: IC5.11(P:V-) IC6.11(P:V-) IC7.11(P:V-) IC8.11(P:V-) IC9.11(P:V-) IC10.11(P:V-) IC11.11(P:V-) IC12.11(P:V-) IC15.11(P:V-) IC16.11(P:V-) IC17.11(P:V-) ; also sheet 1,4
D0: IC16.12(D:+IN) ; also sheet 4
D90: IC16.3(A:+IN) ; also sheet 4
DELTA: C79.- IC16.1(A:OUT) R186.2 R187.1
GND: C80.+ IC14.10(C:+IN) IC14.12(D:+IN) IC15.3(A:+IN) IC15.5(B:+IN) IC15.12(D:+IN) IC16.5(B:+IN) IC17.5(B:+IN) IC17.12(D:+IN) J13.3 J13.7 J13.9 J13.11 J13.13 J13.15 R196.1 ; also sheet 1,2,4
J_DELTA: C77.- IC16.14(D:OUT) R183.2 R189.1 R192.1
J_SIGMA: C78.- IC17.1(A:OUT) R184.2 R188.1
N$11: R199.2 R205.1(A)
N$19: J13.2 R181.2
N$24: C81.+ J13.4
N$59: R187.2 R194.1
N$98: C79.+ IC16.2(A:-IN) R186.1
N$108: C85.- IC17.13(D:-IN) R194.2 R195.2 R204.1
N$123: C80.- IC15.10(C:+IN) R185.2
N$136: J13.5 R181.1
N$149: C85.+ IC17.14(D:OUT) R203.1
N$157: C83.- IC17.6(B:-IN) R190.2 R191.2 R199.1
N$160: C78.+ IC17.2(A:-IN) R184.1
N$162: C83.+ IC17.7(B:OUT) R200.1
N$165: IC14.8(C:OUT) IC14.9(C:-IN)
N$169: R188.2 R195.1
N$171: IC17.10(C:+IN) R192.2 R196.2
N$172: C76.+ IC16.9(C:-IN) R182.1
N$173: IC14.13(D:-IN) IC14.14(D:OUT)
N$174: R189.2 R191.1
N$175: C77.+ IC16.13(D:-IN) R183.1
N$177: C84.- IC17.9(C:-IN) R193.2 R202.1
N$178: C84.+ IC17.8(C:OUT) R201.1
N$180: C82.+ IC15.9(C:-IN) R198.1
N$181: C81.- C82.- IC15.8(C:OUT) R197.1
N$182: J13.14 R197.2 R198.2
N$183: J13.6 R185.1
N$365: IC16.6(B:-IN) IC16.7(B:OUT)
N$368: IC15.1(A:OUT) IC15.2(A:-IN)
N$369: IC15.6(B:-IN) IC15.7(B:OUT)
N$370: IC15.13(D:-IN) IC15.14(D:OUT)
S0: IC17.3(A:+IN) ; also sheet 4
S90: IC16.10(C:+IN) ; also sheet 4
SIGMA: C76.- IC16.8(C:OUT) R182.2 R190.1 R193.1
W: J13.1 J13.8 R200.2 R205.2(E) ; also sheet 1,2
X: J13.10 R201.2 R202.2
Y: J13.12 R203.2 R204.2
Unconnected: J13.16 R205.3(S)

### Notes on the sheet
- Four signals from the phase-sequence matrix are buffered with high impedance buffers. 
  These are S_0 S_90, D_0 and D_90. When viewed on an oscilloscope, S_0 comes 90° 
  before S_90 and so S_0 is used as the 90° phase advance signal J_SIGMA. The same 
  applies to D_0 andJ_DELTA. 
  This gives the required signals to perform the decoding equations with op-amp 
  summing as shown. 
  The signals are effectively inverted here as subtraction was more conveniently 
  implemented as addition and vice-versa. The effective decoding is not changed.  
  The reconstructed W', X' and Y' signals leave the board on a header and exit 
  on a 5 pin male XLR.
  An additional circuit has been added to give an output for a sub-woofer. 
  This simply outputs the mono W signal and has an independent level control 
  and another control to vary the cut-off frequency between about 30 and 200Hz. 
  The filter is a flat, two-pole Butterworth.

## Power pins joined to a net without a drawn wire
+12V: IC3.4(P:V+) IC4.4(P:V+) IC13.4(P:V+) IC14.4(P:V+)
-12V: IC3.11(P:V-) IC4.11(P:V-) IC13.11(P:V-) IC14.11(P:V-)

## Library data of the parts
C1-C4 C8 C9 = SMD:C+
C5-C7 C10-C85 = SMD:C
D1-D4 = SMD:D
IC1 IC2 = SMD:VREG
IC3-IC17 = SMD:TL074: OP AMP
J1-J13 = SMD:CON_16
R1-R204 = SMD:R
R205 = SMD:TRIM